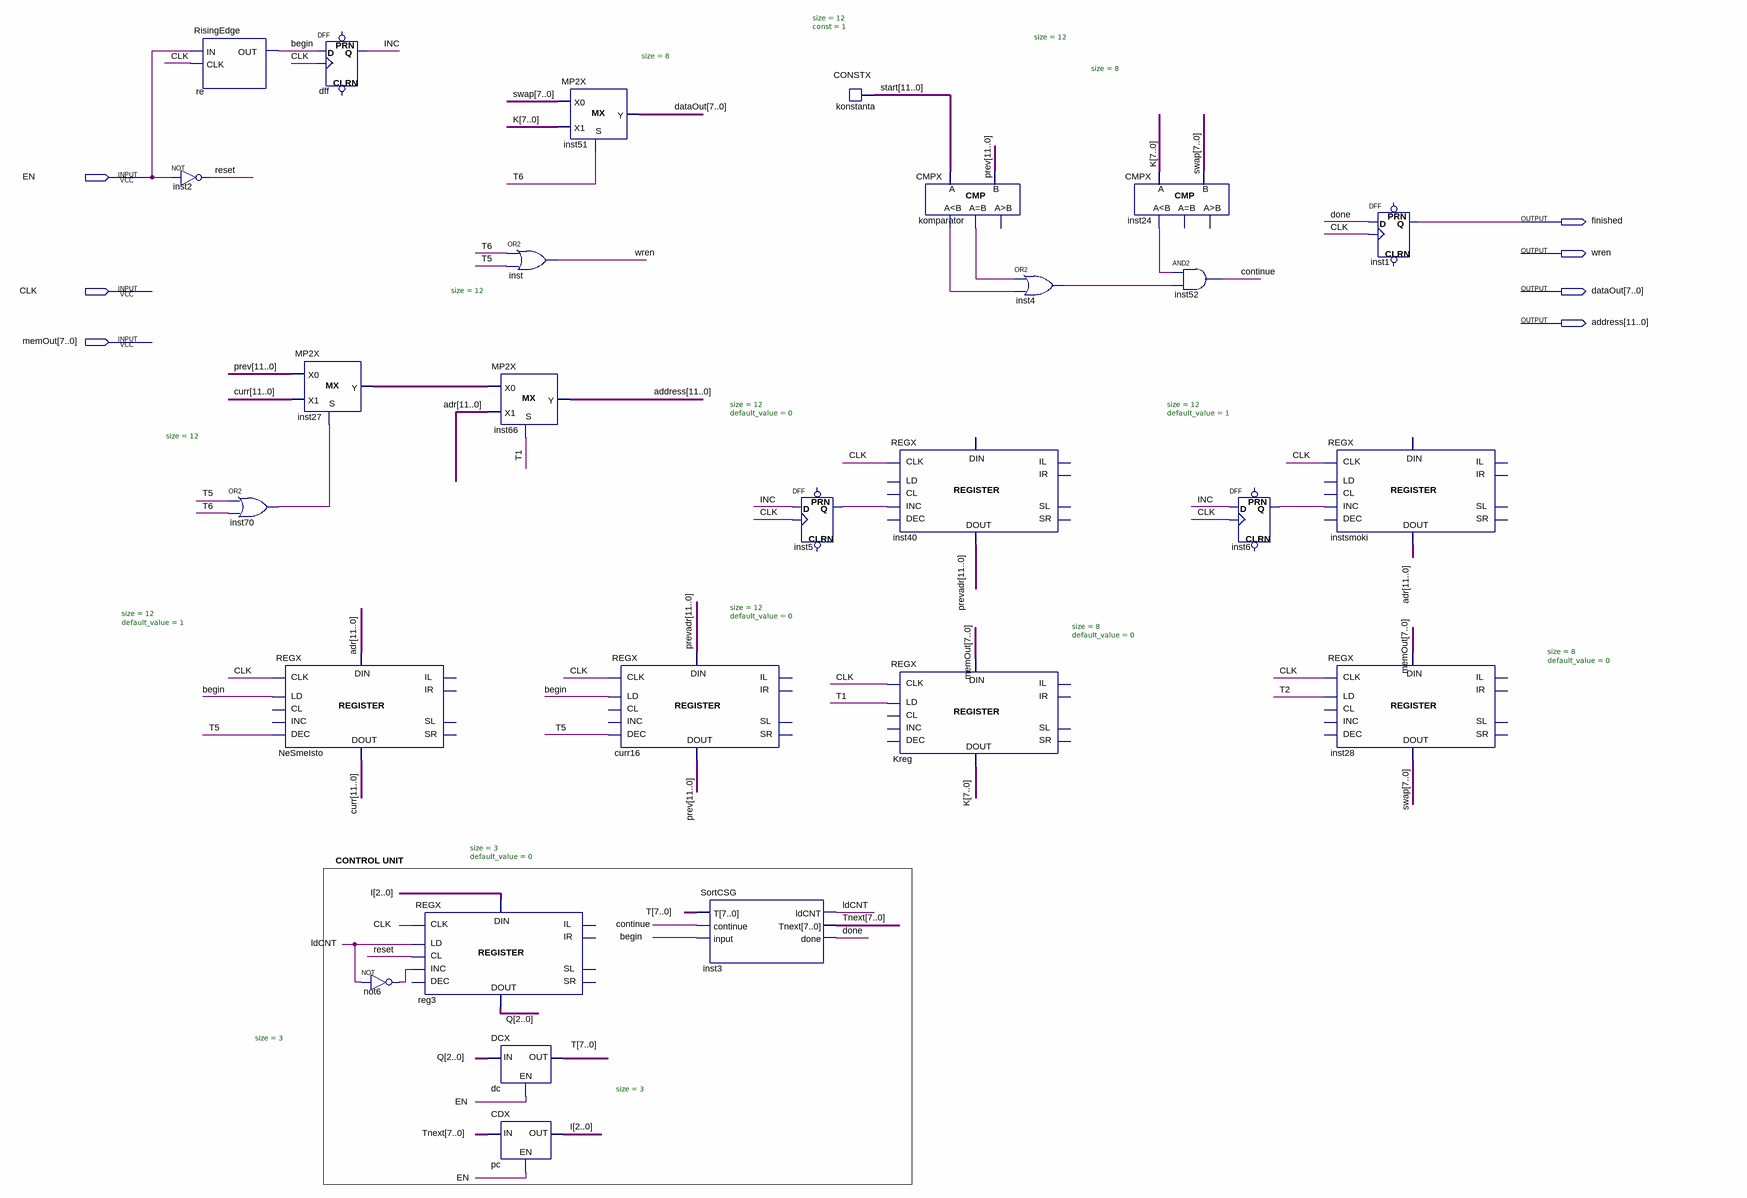
[diagram p0: schematic sheet]
// Quartus schematic Sort.bdf as structural Verilog: 27 symbols, 7 pins
module Sort (
  input  EN,
  input  CLK,
  input  [7:0] memOut,
  output finished,
  output wren,
  output [7:0] dataOut,
  output [11:0] address
);

  wire \begin , \continue , done, INC, inst4_out, inst5_q, inst6_q, inst24_ls, inst70_out, komparator_eq,
       komparator_ls, ldCNT, not6_out, reset;
  wire [2:0] I, Q;
  wire [7:0] K, swap, T, Tnext;
  wire [11:0] adr, curr, inst27_y, prev, prevadr, start;

  not inst2 (reset, EN);
  RisingEdge re (.IN(EN), .CLK(CLK), .OUT(\begin ));
  or inst70 (inst70_out, T[5], T[6]);
  REGX #(.size(12), .default_value(1)) NeSmeIsto (
    .data_in(adr), .clk(CLK), .ld(\begin ), .dec(T[5]), .data_out(curr));  // open: cl, inc, il, ir, sl, sr
  DFF dff (.CLK(CLK), .D(\begin ), .Q(INC));  // open: CLRN, PRN
  MP2X #(.size(12)) inst27 (.S(inst70_out), .X0(prev), .X1(curr), .Y(inst27_y));
  not not6 (not6_out, ldCNT);
  REGX #(.size(3), .default_value(0)) reg3 (
    .data_in(I), .clk(CLK), .ld(ldCNT), .cl(reset), .inc(not6_out), .data_out(Q));  // open: dec, il, ir, sl, sr
  or inst (wren, T[6], T[5]);
  MP2X #(.size(12)) inst66 (.S(T[1]), .X0(inst27_y), .X1(adr), .Y(address));
  DCX #(.size(3)) dc (.EN(EN), .X(Q), .Y(T));
  CDX #(.size(3)) pc (.EN(EN), .X(Tnext), .Y(I));
  MP2X #(.size(8)) inst51 (.S(T[6]), .X0(swap), .X1(K), .Y(dataOut));
  REGX #(.size(12), .default_value(0)) curr16 (
    .data_in(prevadr), .clk(CLK), .ld(\begin ), .dec(T[5]), .data_out(prev));  // open: cl, inc, il, ir, sl, sr
  SortCSG inst3 (.T(T), .\continue (\continue ), .\input (\begin ), .ldCNT(ldCNT), .Tnext(Tnext), .done(done));
  CONSTX #(.size(12), .\const (1)) konstanta (.data(start));
  DFF inst5 (.CLK(CLK), .D(INC), .Q(inst5_q));  // open: CLRN, PRN
  REGX #(.size(12), .default_value(0)) inst40 (
    .clk(CLK), .inc(inst5_q), .data_out(prevadr));  // open: data_in, ld, cl, dec, il, ir, sl, sr
  REGX #(.size(8), .default_value(0)) Kreg (
    .data_in(memOut), .clk(CLK), .ld(T[1]), .data_out(K));  // open: cl, inc, dec, il, ir, sl, sr
  CMPX #(.size(12)) komparator (.A(start), .B(prev), .ls(komparator_ls), .eq(komparator_eq));  // open: gr
  or inst4 (inst4_out, komparator_eq, komparator_ls);
  CMPX #(.size(8)) inst24 (.A(K), .B(swap), .ls(inst24_ls));  // open: eq, gr
  and inst52 (\continue , inst24_ls, inst4_out);
  DFF inst6 (.CLK(CLK), .D(INC), .Q(inst6_q));  // open: CLRN, PRN
  REGX #(.size(12), .default_value(1)) instsmoki (
    .clk(CLK), .inc(inst6_q), .data_out(adr));  // open: data_in, ld, cl, dec, il, ir, sl, sr
  REGX #(.size(8), .default_value(0)) inst28 (
    .data_in(memOut), .clk(CLK), .ld(T[2]), .data_out(swap));  // open: cl, inc, dec, il, ir, sl, sr
  DFF inst1 (.CLK(CLK), .D(done), .Q(finished));  // open: CLRN, PRN

  // Notes on the sheet:
  //   CONTROL UNIT
endmodule
